# Altium schematic sheet buzzer.SchDoc: Buzzer
size A3; DrawnBy: Connor Kwon; Address1: ECE Department; Address2: University of Canterbury; Address3: Christchurch 8041; Address4: New Zealand; Revision: 1
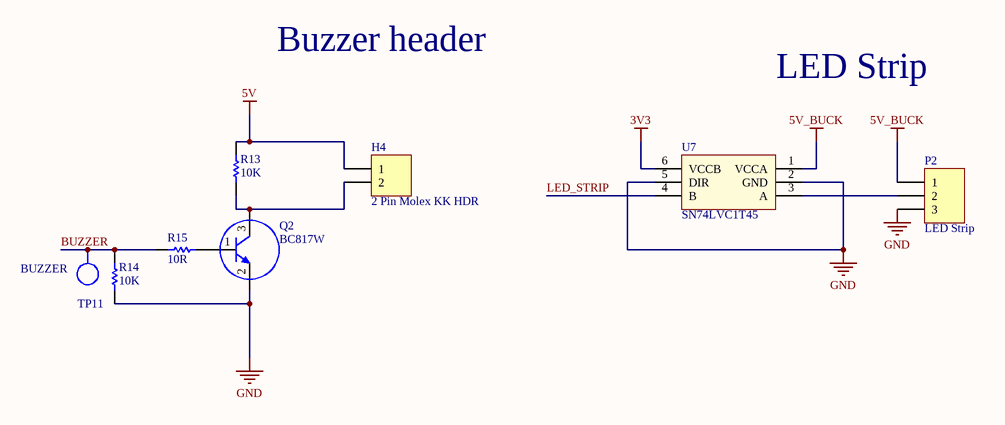
[diagram p0: buzzer.SchDoc]

## Parts
H4  2 Pin Molex KK HDR  [MOLEX_KK_2_HDR]
P2  LED Strip  [MHDR1X3]
Q2  BC817W  [SOT323_M]
R13  10K  [RESC1608L]
R14  10K  [RESC1608L]
R15  10R  [RESC1608L]
TP11  BUZZER  [TP_1206]  (no BOM)
U7  SN74LVC1T45  [SOT23-6_N]

## Nets
3V3: U7.6(VCCB)
5V: H4.1 R13.2
5V_BUCK: P2.1 U7.1(VCCA)
GND: P2.3 Q2.2 R14.1 U7.2(GND) U7.5(DIR)
BUZZER: R14.2 R15.1 TP11.1
LED_STRIP: U7.4(B)
NetH4_2: H4.2 Q2.3 R13.1
NetP2_2: P2.2 U7.3(A)
NetQ2_1: Q2.1 R15.2

## Notes on the sheet
- Buzzer header
- LED Strip
- Title
- Drawn by:
- Date:
- Time:
- Revision:
- Sheet
- of
- File:

## Library data of the parts
H4 = JA_MOLEX_KK_2POS: CONN HEADER 2POS 2.54mm VERT_Thru Hole; Supplier 1: Farnell; Supplier Part Number 1: 1462926; Supplier: ECE Dept; Storage Location: ECE Dept Store; Value: 2 Pin Molex KK HDR
P2 = MHDR1X3: Header, 3-Pin; LatestRevisionDate: 17-Jul-2002; LatestRevisionNote: Re-released for DXP Platform.; Publisher: Altium Limited
Q2 = TB_BC817W: NPN GP Bipolar Transistor 45V 500mA SOT323; Manufacturer: NXP; Supplier 1: Farnell; Supplier Part Number 1: 2114873; Manufacturer PN: BC817W; Storage Location: PCB Assembly WS; Supplier: ECE Dept; Value: BC817W
R13 R14 = RS_10K: RES 10.0K OHM 1/10W 5% 0603 SMD; Storage Location: PCB Assembly WS; Supplier: ECE Dept; Value: 10K
R15 = RS_10R: RES 10 OHM 1/10W 5% 0603 SMD; Storage Location: PCB Assembly WS; Supplier: ECE Dept; Value: 10R
TP11 = TP_1206: Test-Point 3.3x1.6x2.1mm SMD; Manufacturer: Harwin Inc; Manufacturer Part Number: S1751-46R; Value: TP; Manufacturer PN: *; Storage Location: ProtoPlace; Mounting Type: Surface Mount; Type: PC Test Point; Supplier 1: Digi-Key; Supplier Part Number 1: 952-1478-2-ND; Supplier 2: Farnell; Supplier Part Number 2: 1826282; Supplier: ECE Dept
U7 = SN74LVC1T45: 1.8V - 5V level converter